# Altium schematic sheet MAIN.SchDoc
size A3; Organization: Electronic Research & Design; Address1: 11 Granofier; Address2: Zwartkop; Address3: Centurion; Address4: South Africa
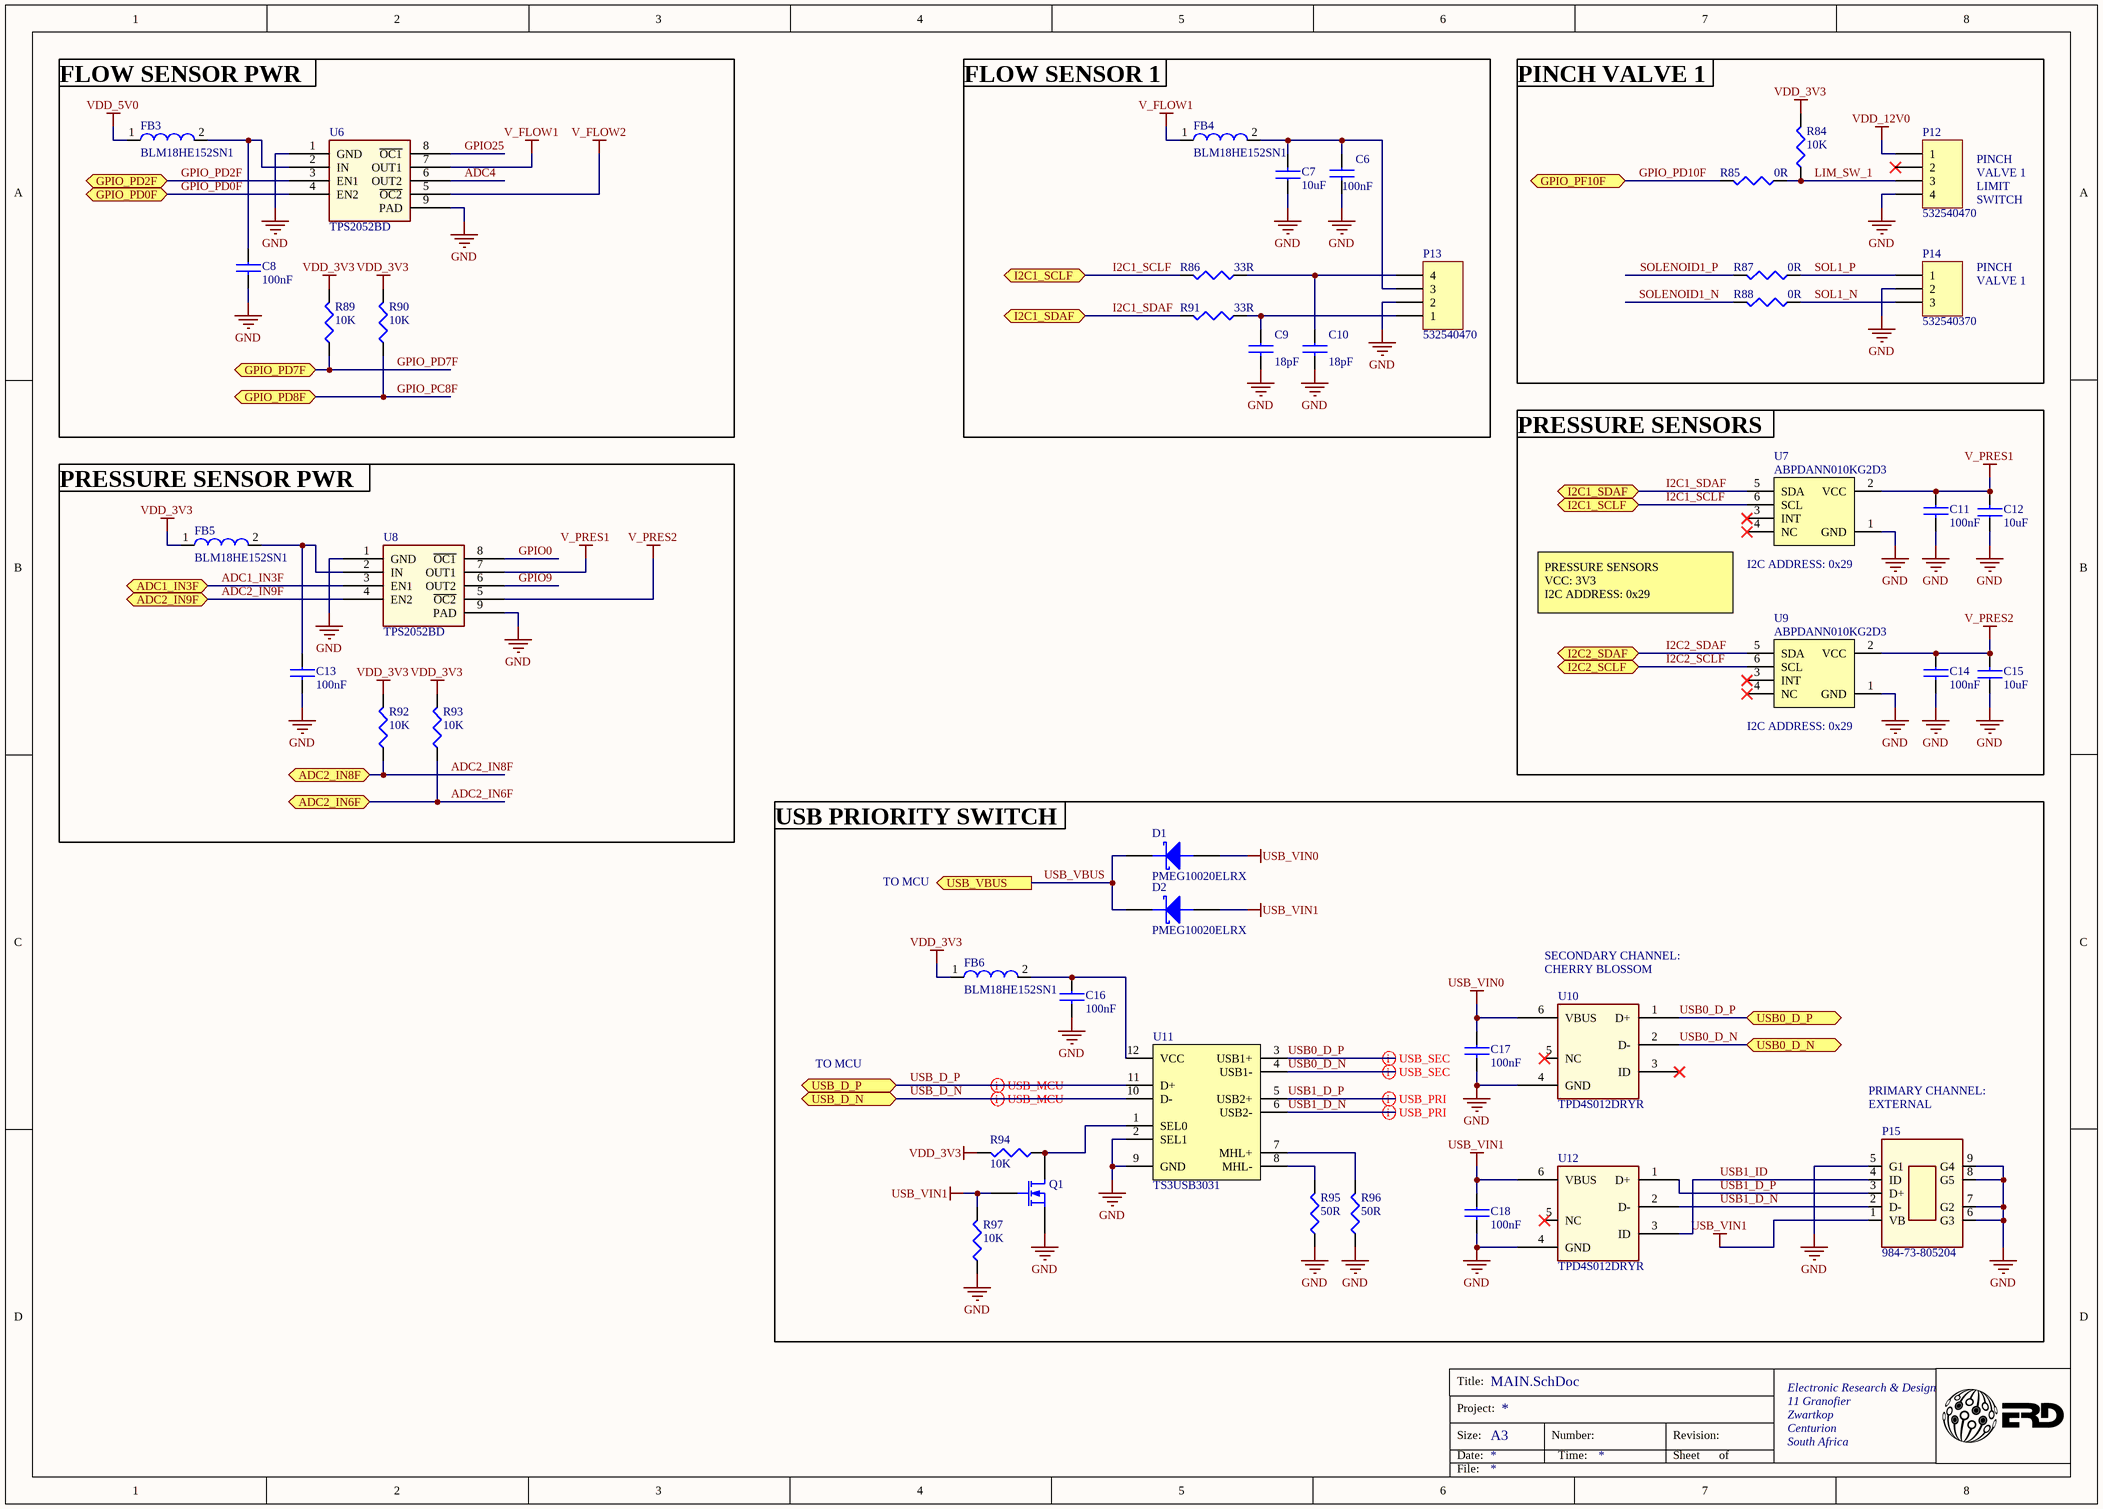
[diagram p0: MAIN.SchDoc]

## Parts
C6  100nF  [CC0402]
C7  10uF  [CC0603]
C8  100nF  [CC0402]
C9  18pF  [CC0402]
C10  18pF  [CC0402]
C11  100nF  [CC0402]
C12  10uF  [CC0603]
C13  100nF  [CC0402]
C14  100nF  [CC0402]
C15  10uF  [CC0603]
C16  100nF  [CC0402]
C17  100nF  [CC0402]
C18  100nF  [CC0402]
D1  PMEG10020ELRX  [SOD123W]
D2  PMEG10020ELRX  [SOD123W]
FB3  BLM18HE152SN1  [LC0603]
FB4  BLM18HE152SN1  [LC0603]
FB5  BLM18HE152SN1  [LC0603]
FB6  BLM18HE152SN1  [LC0603]
P12  532540470  [HDR1X4]
P13  532540470  [HDR1X4]
P14  532540370  [HDR1X3]
P15  984-73-805204  [984-73-805204]
Q1  PMV45EN2R  [SOT23]  (value not drawn)
R84  10K  [RC0402]
R85  0R  [RC0402]
R86  33R  [RC0402]
R87  0R  [RC0402]
R88  0R  [RC0402]
R89  10K  [RC0402]
R90  10K  [RC0402]
R91  33R  [RC0402]
R92  10K  [RC0402]
R93  10K  [RC0402]
R94  10K  [RC0402]
R95  50R  [RC0402]
R96  50R  [RC0402]
R97  10K  [RC0402]
U6  TPS2052BD  [DGN-16X60]
U7  ABPDANN010KG2D3
U8  TPS2052BD  [DGN-16X60]
U9  ABPDANN010KG2D3
U10  TPD4S012DRYR  [U_6_DRY]
U11  TS3USB3031
U12  TPD4S012DRYR  [U_6_DRY]

## Ports
ADC1_IN3F, ADC2_IN6F, ADC2_IN8F, ADC2_IN9F, GPIO_PD0F, GPIO_PD2F, GPIO_PD7F, GPIO_PD8F, GPIO_PF10F, I2C1_SCLF, I2C1_SDAF, I2C2_SCLF, I2C2_SDAF, USB0_D_N (bidir), USB0_D_P (bidir), USB_D_N (bidir), USB_D_P (bidir), USB_VBUS (out)

## Nets
GND: C6.2 C7.1 C8.2 C9.2 C10.2 C11.2 C12.1 C13.2 C14.2 C15.1 C16.2 C17.2 C18.2 P12.4 P13.2 P14.2 P15.5(G1) P15.6(G3) P15.7(G2) P15.8(G5) P15.9(G4) Q1.3(S) R95.1 R96.1 R97.1 U6.1(GND) U6.9(PAD) U7.1(GND) U8.1(GND) U8.9(PAD) U9.1(GND) U10.4(GND) U11.2(SEL1) U11.9(GND) U12.4(GND)
USB_VIN0: C17.1 D1.2 U10.6(VBUS)
USB_VIN1: C18.1 D2.2 P15.1(VB) Q1.2(G) R97.2 U12.6(VBUS)
V_FLOW1: FB4.1 U6.7(OUT1)
V_FLOW2: U6.5(~{OC2})
V_PRES1: C11.1 C12.2 U7.2(VCC) U8.7(OUT1)
V_PRES2: C14.1 C15.2 U8.5(~{OC2}) U9.2(VCC)
VDD_3V3: FB5.1 FB6.1 R84.2 R89.2 R90.2 R92.2 R93.2 R94.2
VDD_5V0: FB3.1
VDD_12V0: P12.1
ADC1_IN3F: U8.3(EN1) ; port ADC1_IN3F
ADC2_IN6F: R93.1 ; port ADC2_IN6F
ADC2_IN8F: R92.1 ; port ADC2_IN8F
ADC2_IN9F: U8.4(EN2) ; port ADC2_IN9F
ADC4: U6.6(OUT2)
GPIO0: U8.8(~{OC1})
GPIO9: U8.6(OUT2)
GPIO25: U6.8(~{OC1})
GPIO_PC8F: R90.1 ; port GPIO_PD8F
GPIO_PD0F: U6.4(EN2) ; port GPIO_PD0F
GPIO_PD2F: U6.3(EN1) ; port GPIO_PD2F
GPIO_PD7F: R89.1 ; port GPIO_PD7F
GPIO_PD10F: R85.2 ; port GPIO_PF10F
I2C1_SCLF: R86.2 U7.6(SCL) ; port I2C1_SCLF
I2C1_SDAF: R91.2 U7.5(SDA) ; port I2C1_SDAF
I2C2_SCLF: U9.6(SCL) ; port I2C2_SCLF
I2C2_SDAF: U9.5(SDA) ; port I2C2_SDAF
LIM_SW_1: P12.3 R84.1 R85.1
SOL1_N: P14.3 R88.1
SOL1_P: P14.1 R87.1
SOLENOID1_N: R88.2
SOLENOID1_P: R87.2
USB0_D_N: U10.2(D-) U11.4(USB1-) ; port USB0_D_N
USB0_D_P: U10.1(D+) U11.3(USB1+) ; port USB0_D_P
USB1_D_N: P15.2(D-) U11.6(USB2-) U12.2(D-)
USB1_D_P: P15.3(D+) U11.5(USB2+) U12.1(D+)
USB1_ID: P15.4(ID) U12.3(ID)
USB_D_N: U11.10(D-) ; port USB_D_N
USB_D_P: U11.11(D+) ; port USB_D_P
USB_VBUS: D1.1 D2.1 ; port USB_VBUS
NetC6_1: C6.1 C7.2 FB4.2 P13.3
NetC8_1: C8.1 FB3.2 U6.2(IN)
NetC9_1: C9.1 P13.1 R91.1
NetC10_1: C10.1 P13.4 R86.1
NetC13_1: C13.1 FB5.2 U8.2(IN)
NetC16_1: C16.1 FB6.2 U11.12(VCC)
NetQ1_1: Q1.1(D) R94.1 U11.1(SEL0)
NetR95_2: R95.2 U11.8(MHL-)
NetR96_2: R96.2 U11.7(MHL+)

Not connected (* = marked no-connect by the designer): P12 2*; U7 3(INT)* 4(NC)*; U9 3(INT)* 4(NC)*; U10 3(ID)* 5(NC)*; U12 5(NC)*

## Layout directives
differential pair: USB0_D_N, USB0_D_P, USB1_D_N, USB1_D_P, USB_D_N, USB_D_P

## Notes on the sheet
- FLOW SENSOR PWR
- FLOW SENSOR 1
- PINCH VALVE 1
- PINCH
- VALVE 1
- LIMIT
- SWITCH
- PRESSURE SENSORS
- PRESSURE SENSOR PWR
- (near U7) I2C ADDRESS: 0x29
- PRESSURE SENSORS
  VCC: 3V3
  I2C ADDRESS: 0x29
- (near U9) I2C ADDRESS: 0x29
- USB PRIORITY SWITCH
- TO MCU
- SECONDARY CHANNEL:
- (near U10) CHERRY BLOSSOM
- PRIMARY CHANNEL:
- EXTERNAL
- Title:
- Size:
- Date:
- Project:
- A3
- Number:
- Time:
- Revision:
- Sheet
- of
- File:

## Library data of the parts
C6 = CAP CER 0.1UF 10V 10% X5R 0402: CAP CER 0.1UF 50V 10% X7R 0402; Manufacturer: Murata; Part Number: GCM155R71H104KE02D; Package / Case: 0402 (1005 Metric); Supplier: AAD
C7 C12 C15 = CAP CER 0.1UF 10V 10% X5R 0402: CAP CER 10UF 25V 20% X5R 0603; Manufacturer: Murata; PartNumber: GRM188R61E106MA73D; Package / Case: 0603; Supplier: AAD
C8 C11 C13 C14 C16-C18 = CAP CER 0.1UF 10V 10% X5R 0402: CAP CER 0.1UF 50V 10% X7R 0402; Manufacturer: Murata; PartNumber: GCM155R71H104KE02D; Package / Case: 0402 (1005 Metric); Supplier: AAD
C9 C10 = CAP CER 2.2UF 6.3V 10% X5R 0402: CAP CER 18pF 50V 5% C0G 0402; Manufacturer: AVX; PartNumber: GJM1555C1H180FB01D; Package / Case: 0402 (1005 Metric); Supplier: AAD; Supplier Stock Code: N/A
D1 D2 = DIODE SCHOTTKY: DIODE, SCHOTTKY, 100V, 2A, 3.7ns, SOD123W; PartNumber: PMEG10020ELRX
FB3-FB6 = FER_180_200_0: FERRITE, 500mA, 500mOHM, 0603; PartNumber: BLM18HE152SN1
P12 P13 = Header 4: Header, RA, 4-circuit, 2mm pitch, TH; Manufacturer: Molex; PartNumber: 532540470
P14 = Header 3: Header, RA, 3-circuit, 2mm pitch, TH; Manufacturer: Molex; PartNumber: 532540370
P15 = MINI-USB-AB-SOCKET: CONN RCPT USB MICRO B R/A SMD; Manufacturer: Pinrex; Manufacturer Part Number: 984-73-805204; Supplier: AAD; Supplier Stock Code: N/A
Q1 = MOSFET-N: N-Channel FET, 20V, 1.5A, 140mOhm, SOT23; pin to pad: 1>D 2>G 3>S; Published: 8-Jun-2000; LatestRevisionDate: 17-Jul-2002; LatestRevisionNote: Re-released for DXP Platform.; PackageVersion: 1995/1996; PackageReference: E3; Publisher: Altium Limited; PackageDescription: TO, Flat Index; 3 In-Line, Axial Leads; Body Dia. 4.6mm; Lead Dia. 0.5 mm (max); PartNumber: PMV45EN2R
R84 = RES_10K_1/16W_1%_0402: RES, 10K OHM, 1/16W, 1%, 0402; Manufacturer: Yageo; Part Number: RC0402FR-0710KL; Package / Case: 0402 (1005 Metric); Supplier: AAD
R85 R87 R88 = RES_10K_1/16W_1%_0402: RES, 0 OHM, 1/16W, 1%, 0402; Manufacturer: Yageo; PartNumber: RC0402FR-070RL; Package / Case: 0402 (1005 Metric); Supplier: AAD
R86 R91 = RES_10K_1/16W_1%_0402: RES, 33 OHM, 1/16W, 1%, 0402; Manufacturer: Yageo; PartNumber: RC0402FR-0733RL; Package / Case: 0402 (1005 Metric); Supplier: AAD
R89 R90 R92-R94 R97 = RES_10K_1/16W_1%_0402: RES, 10K OHM, 1/16W, 1%, 0402; Manufacturer: Yageo; PartNumber: RC0402FR-0710KL; Package / Case: 0402 (1005 Metric); Supplier: AAD
R95 R96 = RES_10K_1/16W_1%_0402: RES, 50 OHM, 1/16W, 1%, 0402; Manufacturer: Yageo; PartNumber: RC0402FR-0749R9L; Package / Case: 0402 (1005 Metric); Supplier: AAD
U6 U8 = TPS2052: IC 0.7A PWR DIST SWITCH 8-MSOP; AltPartNumber: MP6231DH; PartNumber: TPS2052BD
U7 U9 = ABPDANN010KG2D3: Pressure Sensor, APB Series, TH; PartNumber: ABPDANN010KG2D3
U10 U12 = PROT_TPD4S012: ESD 4channel USB Interface; Manufacturer: Texas Instruments; Manufacturer Part Number: TPD4S012DRYR; Package / Case: 6-UFDFN; Supplier: AAD; Supplier Stock Code: N/A
U11 = TS3USB3031: USB Switch, USB 2.0, VQFN-12; PartNumber: TS3USB3031